# Altium schematic sheet LoraSPI.SchDoc
size A4
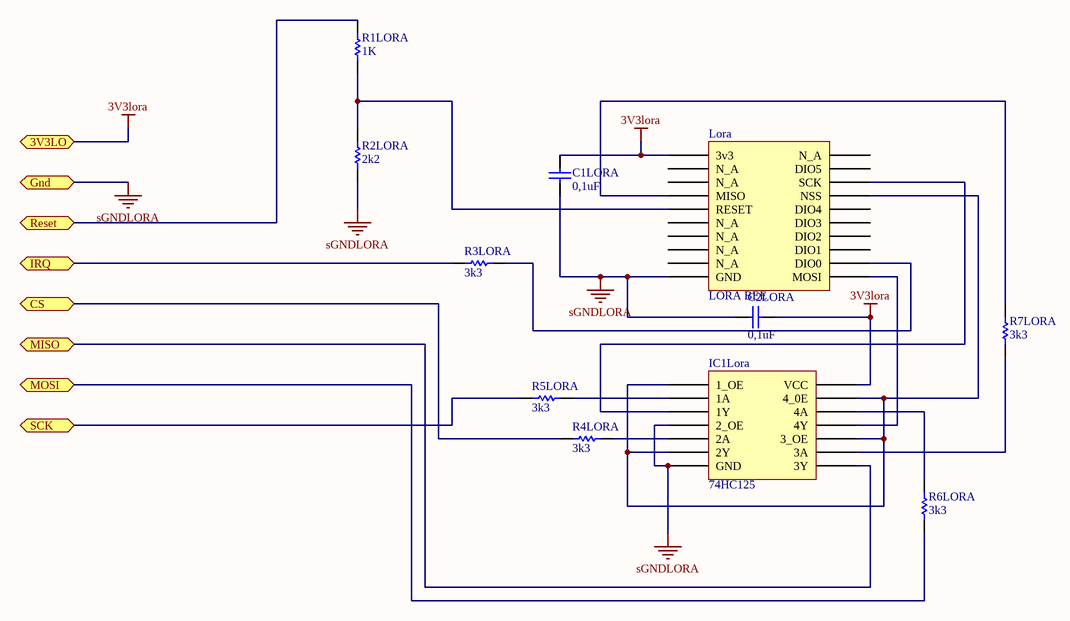
[diagram p0: LoraSPI.SchDoc]

## Parts
C1LORA  0,1uF  [CAP100]
C2LORA  0,1uF  [CAP100]
IC1Lora  74HC125  [DIP14B]
Lora  LORA BEE  [LORABEE]
R1LORA  1K  [RES300]
R2LORA  2k2  [RES300]
R3LORA  3k3  [RES300]
R4LORA  3k3  [RES300]
R5LORA  3k3  [RES300]
R6LORA  3k3  [RES300]
R7LORA  3k3  [RES300]

## Ports
3V3LO (bidir), CS, Gnd, IRQ, MISO, MOSI, Reset, SCK

## Nets
3V3lora: C1LORA.2 C2LORA.2 IC1Lora.14(VCC) Lora.1(3v3) ; port 3V3LO
sGNDLORA: C1LORA.1 C2LORA.1 IC1Lora.4(2_OE) IC1Lora.7(GND) Lora.10(GND) R2LORA.1 ; port Gnd
CS: R4LORA.2 ; port CS
IRQ: R3LORA.2 ; port IRQ
MISO: IC1Lora.8(3Y) ; port MISO
MOSI: R6LORA.1 ; port MOSI
Reset: R1LORA.2 ; port Reset
SCK: R5LORA.2 ; port SCK
NetIC1Lora_1: IC1Lora.1(1_OE) IC1Lora.6(2Y) IC1Lora.10(3_OE) IC1Lora.13(4_0E) Lora.17(NSS)
NetIC1Lora_2: IC1Lora.2(1A) R5LORA.1
NetIC1Lora_3: IC1Lora.3(1Y) Lora.18(SCK)
NetIC1Lora_5: IC1Lora.5(2A) R4LORA.1
NetIC1Lora_9: IC1Lora.9(3A) R7LORA.1
NetIC1Lora_11: IC1Lora.11(4Y) Lora.11(MOSI)
NetIC1Lora_12: IC1Lora.12(4A) R6LORA.2
NetLora_4: Lora.4(MISO) R7LORA.2
NetLora_5: Lora.5(RESET) R1LORA.1 R2LORA.2
NetLora_12: Lora.12(DIO0) R3LORA.1

Not connected (* = marked no-connect by the designer): Lora 2(N_A) 3(N_A) 6(N_A) 7(N_A) 8(N_A) 9(N_A) 13(DIO1) 14(DIO2) 15(DIO3) 16(DIO4) 19(DIO5) 20(N_A)

## Library data of the parts
C1LORA C2LORA = CAP: Capacitor
R1LORA R2LORA R3LORA R4LORA R5LORA R6LORA R7LORA = RES: Resistencia